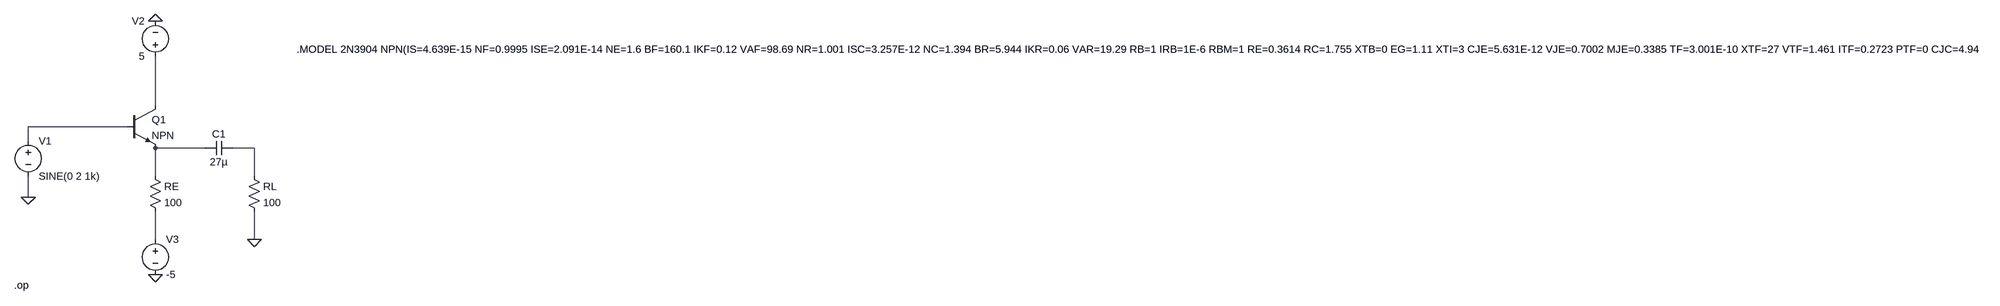
[diagram p0: schematic Lab7_1.asc]
Lab7_1.asc, the LTspice schematic file:
Version 4
SHEET 1 5944 680
WIRE 416 64 416 -48
WIRE 352 112 128 112
WIRE 128 144 128 112
WIRE 528 160 416 160
WIRE 640 160 592 160
WIRE 416 224 416 160
WIRE 640 224 640 160
WIRE 128 272 128 224
WIRE 416 368 416 304
WIRE 640 368 640 304
FLAG 640 368 0
FLAG 128 272 0
FLAG 416 448 0
FLAG 416 -128 0
SYMBOL voltage 128 128 R0
WINDOW 123 0 0 Left 0
WINDOW 39 0 0 Left 0
SYMATTR InstName V1
SYMATTR Value SINE(0 2 1k)
SYMBOL npn 352 64 R0
SYMATTR InstName Q1
SYMBOL res 400 208 R0
SYMATTR InstName RE
SYMATTR Value 100
SYMBOL res 624 208 R0
SYMATTR InstName RL
SYMATTR Value 100
SYMBOL cap 592 144 R90
WINDOW 0 0 32 VBottom 2
WINDOW 3 32 32 VTop 2
SYMATTR InstName C1
SYMATTR Value 27µ
SYMBOL voltage 416 -32 R180
WINDOW 0 24 96 Left 2
WINDOW 3 24 16 Left 2
WINDOW 123 0 0 Left 0
WINDOW 39 0 0 Left 0
SYMATTR InstName V2
SYMATTR Value 5
SYMBOL voltage 416 352 R0
WINDOW 123 0 0 Left 0
WINDOW 39 0 0 Left 0
SYMATTR InstName V3
SYMATTR Value -5
TEXT 96 472 Left 2 !.op
TEXT 736 -64 Left 2 !.MODEL 2N3904 NPN(IS=4.639E-15 NF=0.9995 ISE=2.091E-14 NE=1.6 BF=160.1 IKF=0.12 VAF=98.69 NR=1.001 ISC=3.257E-12 NC=1.394 BR=5.944 IKR=0.06 VAR=19.29 RB=1 IRB=1E-6 RBM=1 RE=0.3614 RC=1.755 XTB=0 EG=1.11 XTI=3 CJE=5.631E-12 VJE=0.7002 MJE=0.3385 TF=3.001E-10 XTF=27 VTF=1.461 ITF=0.2723 PTF=0 CJC=4.949E-12 VJC=0.5969 MJC=0.1928 XCJC=0.864 TR=9.4E-8 CJS=0 VJS=0.75 MJS=0.333 FC=0.5582)

The netlist it stands for:
* Lab7_1.asc
V1 N002 0 SINE(0 2 1k)
Q1 N001 N002 N003 0 NPN
RE N003 N005 100
RL N004 0 100
C1 N004 N003 27µ
V2 N001 0 5
V3 N005 0 -5
.model NPN NPN
.model PNP PNP
.lib standard.bjt
.op
.MODEL 2N3904 NPN(IS=4.639E-15 NF=0.9995 ISE=2.091E-14 NE=1.6 BF=160.1 IKF=0.12 VAF=98.69 NR=1.001 ISC=3.257E-12 NC=1.394 BR=5.944 IKR=0.06 VAR=19.29 RB=1 IRB=1E-6 RBM=1 RE=0.3614 RC=1.755 XTB=0 EG=1.11 XTI=3 CJE=5.631E-12 VJE=0.7002 MJE=0.3385 TF=3.001E-10 XTF=27 VTF=1.461 ITF=0.2723 PTF=0 CJC=4.949E-12 VJC=0.5969 MJC=0.1928 XCJC=0.864 TR=9.4E-8 CJS=0 VJS=0.75 MJS=0.333 FC=0.5582)
.backanno
.end